# EAGLE design clock13 (EAGLE 7.7.0)
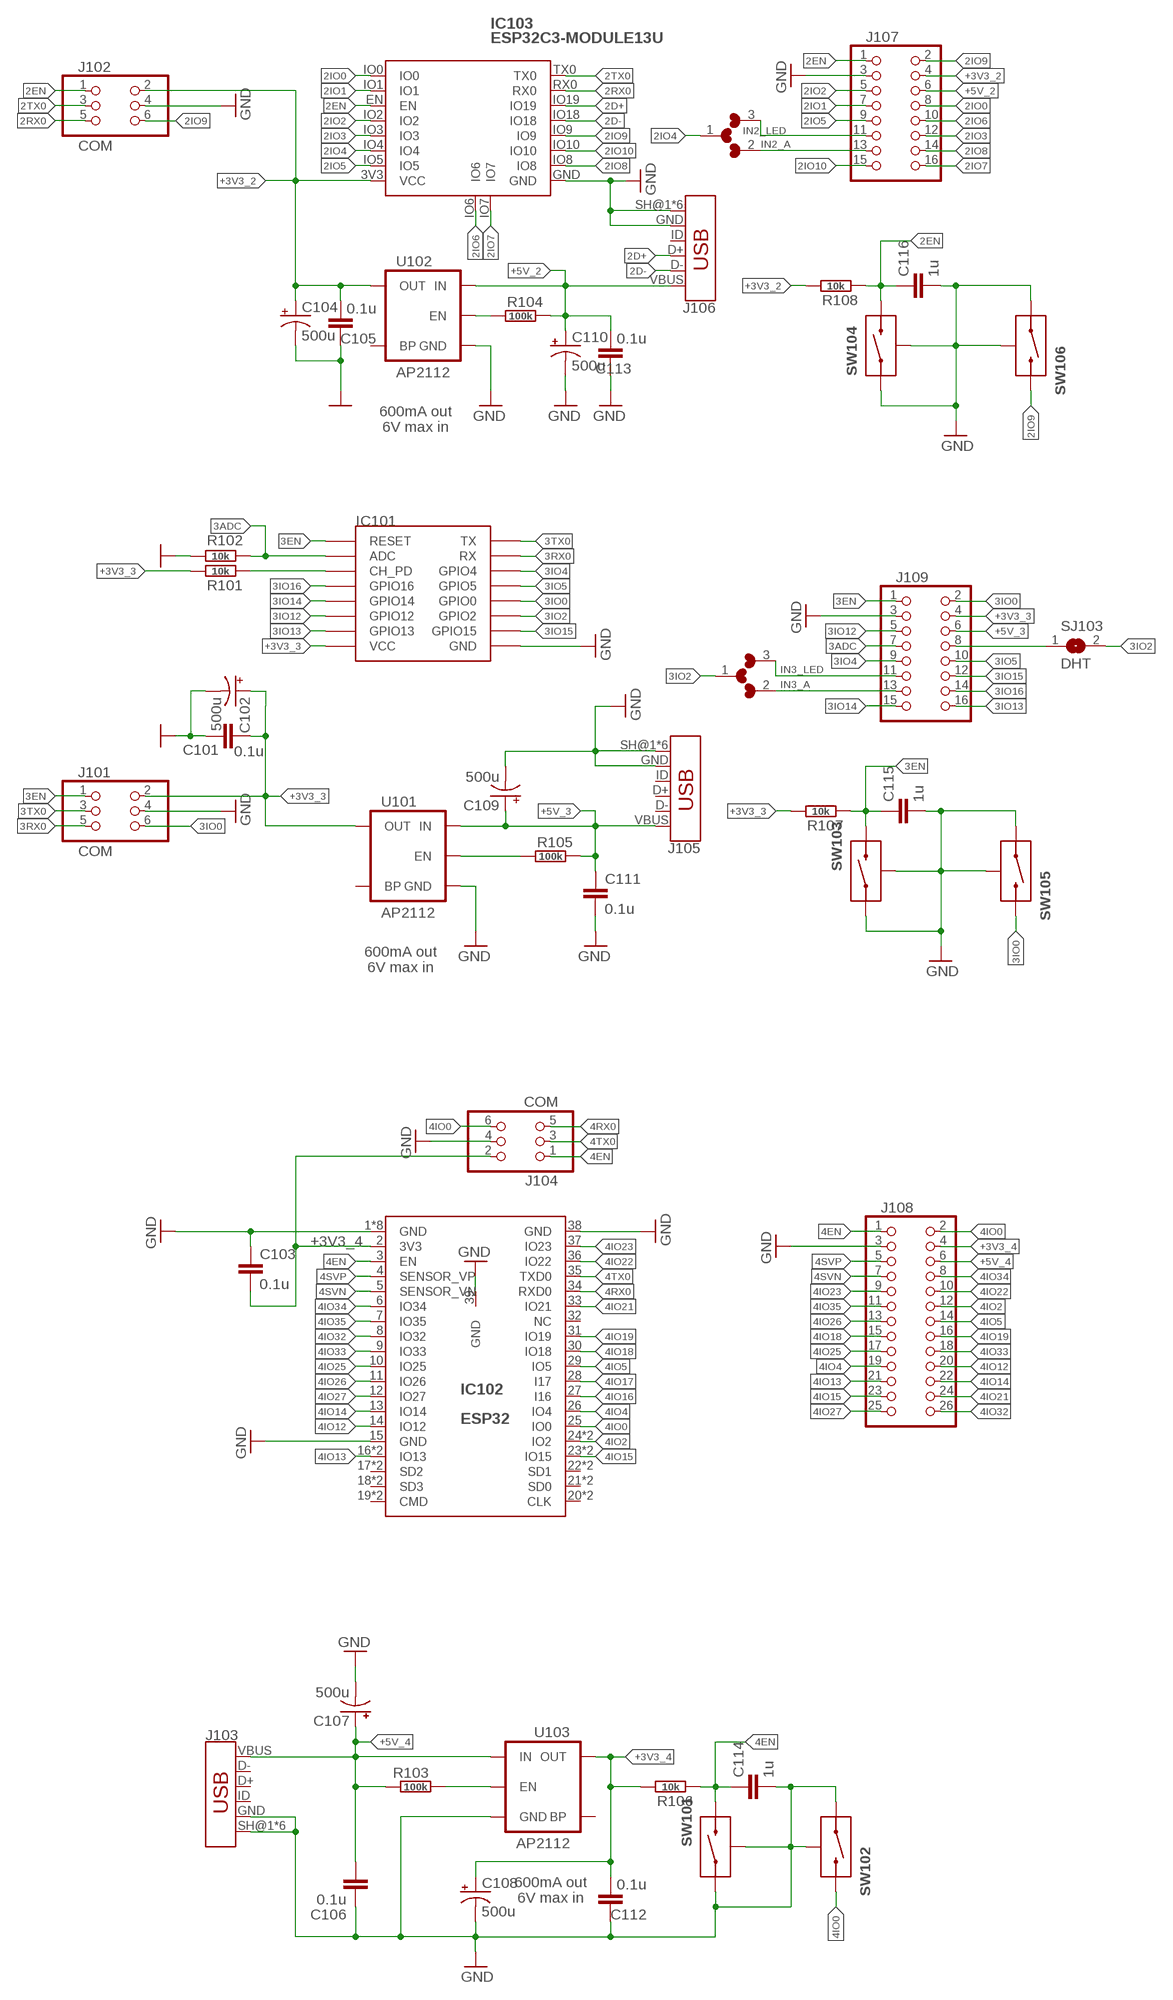
[diagram p0: schematic, sheet 1]

## Parts
C101  0.1u  CAP0603-CAP  [0603-CAP]
C102  500u  CAP_POLPTH1  [CPOL-RADIAL-100UF-25V]
C103  0.1u  CAP0603-CAP  [0603-CAP]
C104  500u  CAP_POLPTH1  [CPOL-RADIAL-100UF-25V]
C105  0.1u  CAP0603-CAP  [0603-CAP]
C106  0.1u  CAP0603-CAP  [0603-CAP]
C107  500u  CAP_POLPTH1  [CPOL-RADIAL-100UF-25V]
C108  500u  CAP_POLPTH1  [CPOL-RADIAL-100UF-25V]
C109  500u  CAP_POLPTH1  [CPOL-RADIAL-100UF-25V]
C110  500u  CAP_POLPTH1  [CPOL-RADIAL-100UF-25V]
C111  0.1u  CAP0603-CAP  [0603-CAP]
C112  0.1u  CAP0603-CAP  [0603-CAP]
C113  0.1u  CAP0603-CAP  [0603-CAP]
C114  1u  CAP0603-CAP  [0603-CAP]
C115  1u  CAP0603-CAP  [0603-CAP]
C116  1u  CAP0603-CAP  [0603-CAP]
IC101  ESP12SMD  [ESP12-SMD]
IC102  ESP32  ESP32-MODULEDUAL  [ESP32-WROOVER/WROOM]
IC103  ESP32C3-MODULE13U  [ESP32C3-13U]
J101  COM  HEADER-2X3SMT  [2X03_SMT]
J102  COM  HEADER-2X3SMT  [2X03_SMT]
J103  USB_MICRO-BFEMALE_SMT_  [USB-B-MICRO-SMD_MY]
J104  COM  HEADER-2X3SMT  [2X03_SMT]
J105  USB_MICRO-BFEMALE_SMT_  [USB-B-MICRO-SMD_MY]
J106  USB_MICRO-BFEMALE_SMT_  [USB-B-MICRO-SMD_MY]
J107  HEADER-2X8  [2X8]
J108  HEADER-2X13  [2X13]
J109  HEADER-2X8  [2X8]
R101  10k  R-EU_R0603  [R0603]
R102  10k  R-EU_R0603  [R0603]
R103  100k  R-EU_R0603  [R0603]
R104  100k  R-EU_R0603  [R0603]
R105  100k  R-EU_R0603  [R0603]
R106  10k  R-EU_R0603  [R0603]
R107  10k  R-EU_R0603  [R0603]
R108  10k  R-EU_R0603  [R0603]
SJ101  L/W  MICROBUILDER_SOLDERJUMPER3  [MICROBUILDER_SOLDERJUMPER_ARROW_NOPASTE_3]
SJ102  L/W  MICROBUILDER_SOLDERJUMPER3  [MICROBUILDER_SOLDERJUMPER_ARROW_NOPASTE_3]
SJ103  DHT  MICROBUILDER_SOLDERJUMPER  [MICROBUILDER_SOLDERJUMPER_ARROW_NOPASTE]
SW101  RST  MICROSWITCH-BUTTON  [MICROPUSH-BUT_TOP]
SW102  PRG  MICROSWITCH-BUTTON  [MICROPUSH-BUT_TOP]
SW103  RST  MICROSWITCH-BUTTON  [MICROPUSH-BUT_TOP]
SW104  RST  MICROSWITCH-BUTTON  [MICROPUSH-BUT_TOP]
SW105  PRG  MICROSWITCH-BUTTON  [MICROPUSH-BUT_TOP]
SW106  PRG  MICROSWITCH-BUTTON  [MICROPUSH-BUT_TOP]
U101  AP2112  V_REG_LDOSMD  [SOT23-5]
U102  AP2112  V_REG_LDOSMD  [SOT23-5]
U103  AP2112  V_REG_LDOSMD  [SOT23-5]

## Nets
1EN_P: R103.2 U103.3(EN)
2D+: IC103.IO19 J106.D+
2D-: IC103.IO18 J106.D-
2EN: C116.1 IC103.EN J102.1 J107.1 R108.1 SW104.B
2EN_P: R104.2 U102.3(EN)
2IO0: IC103.IO0 J107.8
2IO1: IC103.IO1 J107.7
2IO2: IC103.IO2 J107.5
2IO3: IC103.IO3 J107.12
2IO4: IC103.IO4 SJ101.1
2IO5: IC103.IO5 J107.9
2IO6: IC103.IO6 J107.10
2IO7: IC103.IO7 J107.16
2IO8: IC103.IO8 J107.14
2IO9: IC103.IO9 J102.6 J107.2 SW106.B
2IO10: IC103.IO10 J107.15
2RX0: IC103.RX0 J102.5
2TX0: IC103.TX0 J102.3
3ADC: IC101.ADC J109.7 R102.1
3EN: C115.1 IC101.RESET J101.1 J109.1 R107.1 SW103.B
3EN_P: R105.2 U101.3(EN)
3IO0: IC101.GPIO0 J101.6 J109.2 SW105.B
3IO2: IC101.GPIO2 SJ102.1 SJ103.2
3IO4: IC101.GPIO4 J109.9
3IO5: IC101.GPIO5 J109.10
3IO12: IC101.GPIO12 J109.5
3IO13: IC101.GPIO13 J109.16
3IO14: IC101.GPIO14 J109.15
3IO15: IC101.GPIO15 J109.12
3IO16: IC101.GPIO16 J109.14
3RX0: IC101.RXD0(RX) J101.5
3TX0: IC101.TXD0(TX) J101.3
4EN: C114.1 IC102.3(EN) J104.1 J108.1 R106.1 SW101.B
4IO0: IC102.25(IO0) J104.6 J108.2 SW102.B
4IO2: IC102.24(IO2) IC102.48(IO2) J108.12
4IO4: IC102.26(IO4) J108.19
4IO5: IC102.29(IO5) J108.14
4IO12: IC102.14(IO12) J108.20
4IO13: IC102.16(IO13) IC102.40(IO13) J108.21
4IO14: IC102.13(IO14) J108.22
4IO15: IC102.23(IO15) IC102.47(IO15) J108.23
4IO16: IC102.27(I16)
4IO17: IC102.28(I17)
4IO18: IC102.30(IO18) J108.15
4IO19: IC102.31(IO19) J108.16
4IO21: IC102.33(IO21) J108.24
4IO22: IC102.36(IO22) J108.10
4IO23: IC102.37(IO23) J108.9
4IO25: IC102.10(IO25) J108.17
4IO26: IC102.11(IO26) J108.13
4IO27: IC102.12(IO27) J108.25
4IO32: IC102.8(IO32) J108.26
4IO33: IC102.9(IO33) J108.18
4IO34: IC102.6(IO34) J108.8
4IO35: IC102.7(IO35) J108.11
4RX0: IC102.34(RXD0) J104.5
4SVN: IC102.5(SENSOR_VN) J108.7
4SVP: IC102.4(SENSOR_VP) J108.5
4TX0: IC102.35(TXD0) J104.3
+3V3_2: C104.1(+) C105.2 IC103.3V3(VCC) J102.2 J107.4 R108.2 U102.5(OUT)
+3V3_3 [power]: C101.2 C102.1(+) IC101.VCC J101.2 J109.4 R101.2 R107.2 U101.5(OUT)
+3V3_4: C103.2 C108.1(+) C112.2 IC102.2(3V3) J104.2 J108.4 R106.2 U103.5(OUT)
+5V_2: C110.1(+) C113.2 J106.VBUS J107.6 R104.1 U102.1(IN)
+5V_3 [power]: C109.1(+) C111.1 J105.VBUS J109.6 R105.1 U101.1(IN)
+5V_4: C106.1 C107.1(+) J103.VBUS J108.6 R103.1 U103.1(IN)
GND: C101.1 C102.2(-) C103.1 C104.2(-) C105.1 C106.2 C107.2(-) C108.2(-) C109.2(-) C110.2(-) C111.2 C112.1 C113.1 C114.2 C115.2 C116.2 IC101.GND IC102.1(GND) IC102.15(GND) IC102.38(GND) IC102.39(GND) IC102.GND IC102.PAD$1(GND) IC102.PAD$4(GND) IC102.PAD$5(GND) IC102.PAD$7(GND) IC102.PAD$8(GND) IC102.PAD$9(GND) IC103.GND J101.4 J102.4 J103.GND J103.SH@1(SHIELD) J103.SH@2(SHIELD) J103.SH@3(SHIELD) J103.SH@4(SHIELD) J103.SH@5(SHIELD) J103.SH@6(SHIELD) J104.4 J105.GND J105.SH@1(SHIELD) J105.SH@2(SHIELD) J105.SH@3(SHIELD) J105.SH@4(SHIELD) J105.SH@5(SHIELD) J105.SH@6(SHIELD) J106.GND J106.SH@1(SHIELD) J106.SH@2(SHIELD) J106.SH@3(SHIELD) J106.SH@4(SHIELD) J106.SH@5(SHIELD) J106.SH@6(SHIELD) J107.3 J108.3 J109.3 R102.2 SW101.A SW101.SH0(SH) SW102.A SW102.SH0(SH) SW103.A SW103.SH0(SH) SW104.A SW104.SH0(SH) SW105.A SW105.SH0(SH) SW106.A SW106.SH0(SH) U101.2(GND) U102.2(GND) U103.2(GND)
IN2_A: J107.13 SJ101.2
IN2_LED: J107.11 SJ101.3
IN3_A: J109.13 SJ102.2
IN3_DHT: J109.8 SJ103.1
IN3_LED: J109.11 SJ102.3
N$1: IC101.CH_PD R101.1
Unconnected: IC102.17(SD2) IC102.18(SD3) IC102.19(CMD) IC102.20(CLK) IC102.21(SD0) IC102.22(SD1) IC102.32(NC) IC102.41(SD2) IC102.42(SD3) IC102.43(CMD) IC102.44(CLK) IC102.45(SD0) IC102.46(SD1) J103.D+ J103.D- J103.ID J105.D+ J105.D- J105.ID J106.ID U101.4(BP) U102.4(BP) U103.4(BP)

## Notes on the sheet
- 600mA out
  6V max in
- 600mA out
  6V max in
- 600mA out
  6V max in

## Library data of the parts
C101 C103 C105 C106 C111-C116 = radiva5:CAP: Capacitor Standard 0603 ceramic capacitor, and 0.1" leaded capacitor.
C102 C104 C107-C110 = radiva5:CAP_POL: Capacitor Polarized These are standard SMD and PTH capacitors. Normally 10uF, 47uF, and 100uF in electrolytic and tantalum varieties. Always verify the external diameter of the through hole cap, it varies with capacity, voltage, and manufacturer. The EIA devices should be standard.
IC101 = clock02:ESP12: ESP8266 Wifi module 12
IC102 = radiva5:ESP32-MODULE
IC103 = radiva5:ESP32C3-MODULE
J101 J102 J104 = radiva5:HEADER-2X3: PIN HEADER
J103 J105 J106 = radiva5:USB_MICRO-B: USB Type Micro-B Connector Male/female and PTH/SMT variants SparkFun Products: SparkFun microB USB Breakout <?https://www.sparkfun.com/products/12035?> SparkFun USB microB Plug Breakout <?https://www.sparkfun.com/products/10031?> SparkFun ESP8266 Thing <?https://www.sparkfun.com/products/13231?>
J107 J109 = radiva5:HEADER-2X8: PIN HEADER
J108 = radiva5:HEADER-2X13: PIN HEADER
R101-R108 = radiva5:R-EU_: RESISTOR, European symbol
SJ101 SJ102 = radiva5:MICROBUILDER_SOLDERJUMPER3: SMD Solder JUMPER Solder the two pads together to create a connection, or remove the solder to break it. REFLOW - Use this footprint for solder paste and reflow ovens. WAVE - Use this footprint for hand-soldering (larger pads). CLOSED - Has a trace between the two pads to ensure it is closed by default. The trace needs to be cut to disable the jumper, and can be closed again by creating a solder bridge between the two pads.
SJ103 = radiva5:MICROBUILDER_SOLDERJUMPER: SMD Solder JUMPER Solder the two pads together to create a connection, or remove the solder to break it. REFLOW - Use this footprint for solder paste and reflow ovens. WAVE - Use this footprint for hand-soldering (larger pads). CLOSED - Has a trace between the two pads to ensure it is closed by default. The trace needs to be cut to disable the jumper, and can be closed again by creating a solder bridge between the two pads.; BOM: EXCLUDE
SW101-SW106 = radiva5:MICROSWITCH-BUTTON
U101-U103 = SparkFun-PowerIC:V_REG_LDO: Voltage Regulator LDO Standard 150mA LDO voltage regulator in SOT-23 layout. Micrel part MIC5205. BP (by-pass) pin is used to lower output noise with 470pF cap.; PROD_ID: VREG-12457

## Net classes
0 default: clearance 0.205 mm
1 power: width 0.406 mm

## Board
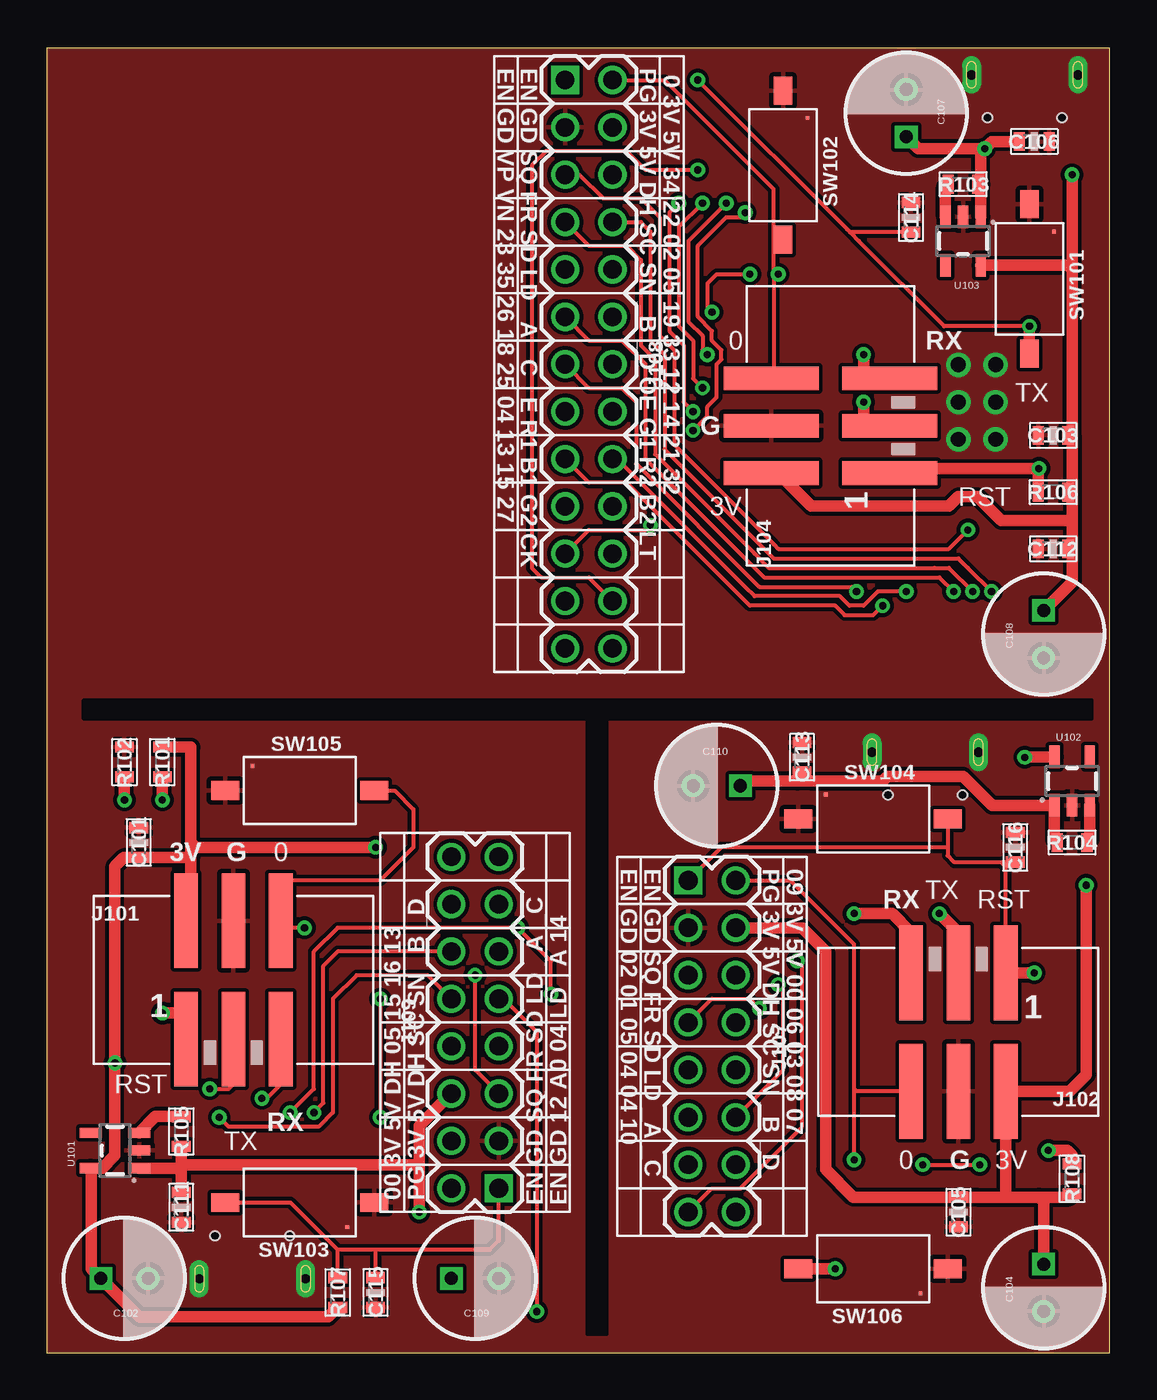
[diagram p1: board, top side]
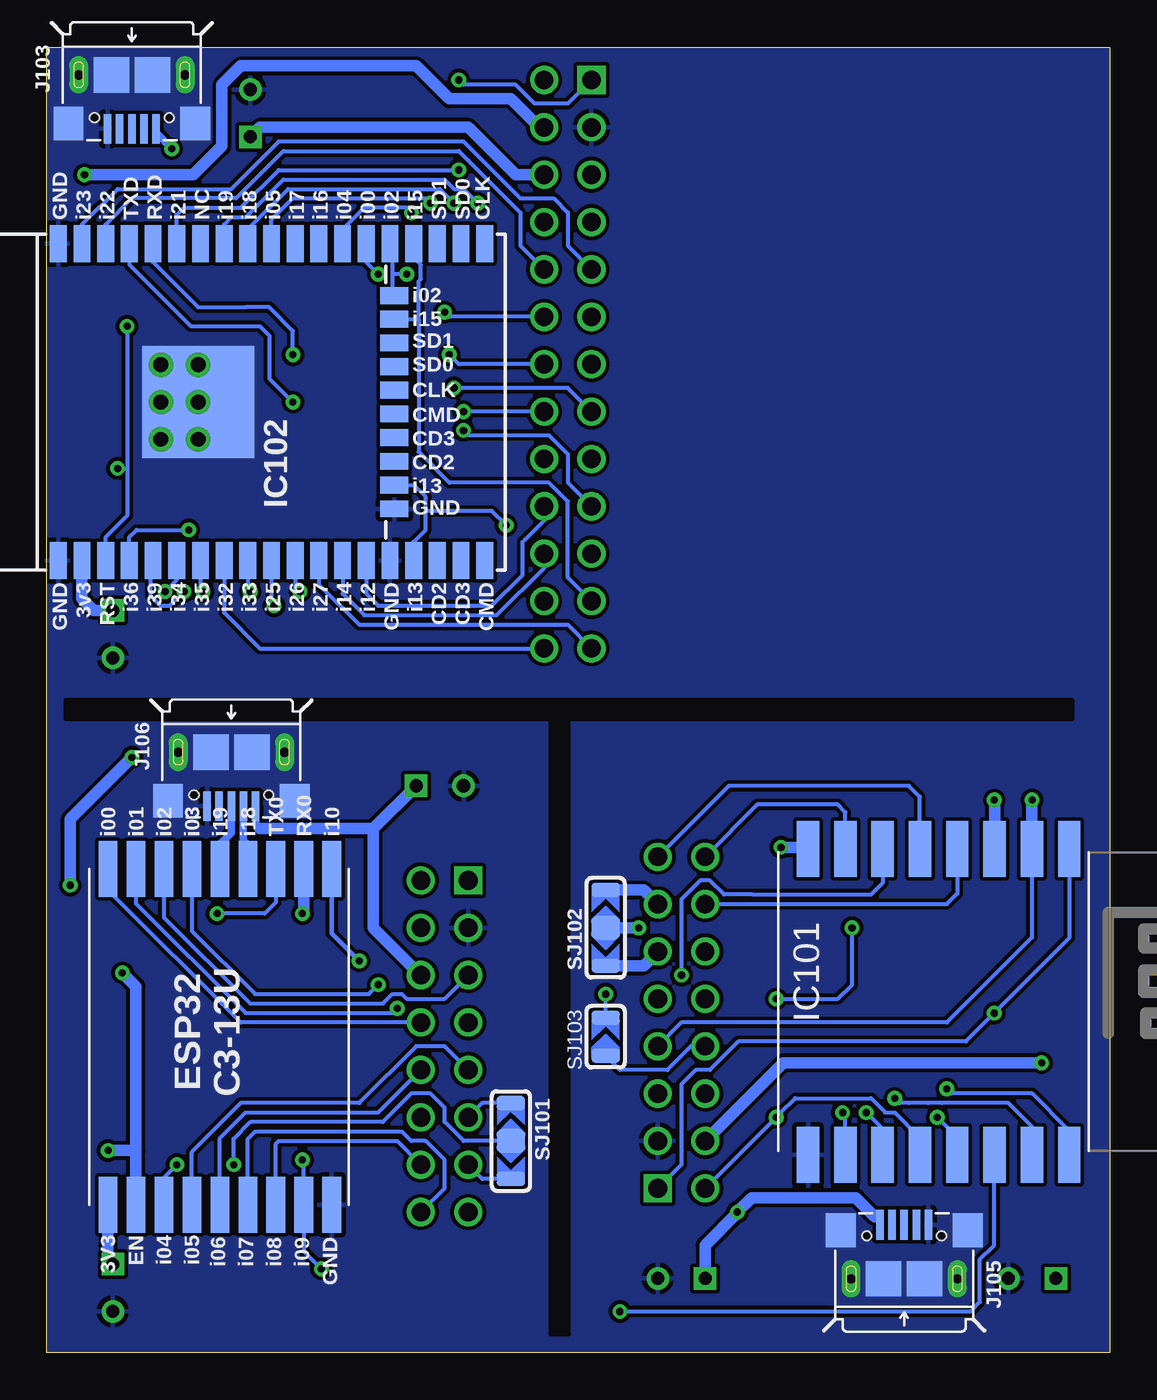
[diagram p2: board, bottom side, seen from below]

Size 57 x 70 mm. Coordinates in mm from the lower left corner, seen from the top.
Outline: 0,70 0,0 57,0 57,70 0,70
Copper layers (1*16): Top 0.035mm / dielectric 1.5mm / Bottom 0.035mm
Design rules "default *": minimum track width 8mil, minimum drill 15mil, track to track 8mil, track to pad 8mil, pad to pad 8mil, via to via 8mil, smd to smd 8mil, copper to edge 1mil, drill to drill 8mil, minimum pad ring 10mil, minimum via ring 8mil, stop-mask expansion 4mil, vias tented up to drill 20mil, thermal gap 10mil

### Footprints (pad centres in the part's own frame; a part is rotated, then mirrored left to right if it is on the bottom)
0603-CAP = smd 0.6 x 1: 1 -0.8,0; 2 0.8,0
CPOL-RADIAL-100UF-25V = drill 0.7 square: 1 1.27,0 | drill 0.7: 2 -1.27,0
ESP12-SMD = smd 3 x 1.2: ADC -8.3,3.8; CH_PD -8.3,1.8; GND 8.1,-8.2; GPIO0 8.1,-2.2; GPIO2 8.1,-4.2; GPIO4 8.1,1.8; GPIO5 8.1,-0.2; GPIO12 -8.3,-4.2; GPIO13 -8.3,-6.2; GPIO14 -8.3,-2.2; GPIO15 8.1,-6.2; GPIO16 -8.3,-0.2; RESET -8.3,5.8; RXD0 8.1,3.8; TXD0 8.1,5.8; VCC -8.3,-8.2
ESP32-WROOVER/WROOM = smd 2 x 0.9: 1 -8.5,7.5; 2 -8.5,6.23; 3 -8.5,4.96; 4 -8.5,3.69; 5 -8.5,2.42; 6 -8.5,1.15; 7 -8.5,-0.12; 8 -8.5,-1.39; 9 -8.5,-2.66; 10 -8.5,-3.93; 11 -8.5,-5.2; 12 -8.5,-6.47; 13 -8.5,-7.74; 14 -8.5,-9.01; 15 -8.5,-10.28; 16 -8.5,-11.55; 17 -8.5,-12.82; 18 -8.5,-14.09; 19 -8.5,-15.36; 20 8.5,-15.36; 21 8.5,-14.09; 22 8.5,-12.82; 23 8.5,-11.55; 24 8.5,-10.28; 25 8.5,-9.01; 26 8.5,-7.74; 27 8.5,-6.47; 28 8.5,-5.2; 29 8.5,-3.93; 30 8.5,-2.66; 31 8.5,-1.39; 32 8.5,-0.12; 33 8.5,1.15; 34 8.5,2.42; 35 8.5,3.69; 36 8.5,4.96; 37 8.5,6.23; 38 8.5,7.5 | smd 0.9 x 1.5: 39 -5.725,-10.5; 40 -4.445,-10.5; 41 -3.175,-10.5; 42 -1.905,-10.5; 43 -0.635,-10.5; 44 0.635,-10.5; 45 1.905,-10.5; 46 3.175,-10.5; 47 4.445,-10.5; 48 5.715,-10.5 | smd 6 x 6: GND 0,0 | drill 0.8: PAD$1 -2,2; PAD$4 0,2; PAD$5 2,2; PAD$7 -2,0; PAD$8 0,0; PAD$9 2,0
ESP32C3-13U = smd 3 x 1: 3V3 -9,5.6; EN -9,4.1; GND -9,-6.4; IO0 9,5.6; IO1 9,4.1; IO2 9,2.6; IO3 9,1.1; IO4 -9,2.6; IO5 -9,1.1; IO6 -9,-0.4; IO7 -9,-1.9; IO8 -9,-3.4; IO9 -9,-4.9; IO10 9,-6.4; IO18 9,-1.9; IO19 9,-0.4; RX0 9,-4.9; TX0 9,-3.4
2X03_SMT = smd 1.27 x 5.08: 1 -2.54,-3.175; 2 -2.54,3.175; 3 0,-3.175; 4 0,3.175; 5 2.54,-3.175; 6 2.54,3.175
USB-B-MICRO-SMD_MY = smd 1.6 x 0.4: D+ -4.4,0; D- -4.4,-0.65; GND -4.4,1.3; ID -4.4,0.65; VBUS -4.4,-1.3 | drill 0.5 long: SH@1 -1.5,-2.85; SH@2 -1.5,2.85 | smd 1.9 x 1.9: SH@3 -1.5,-1.1; SH@4 -1.5,1.1 | smd 1.8 x 1.6: SH@5 -4.1,-3.4; SH@6 -4.1,3.4 | hole 0.5: -3.8,-2; -3.8,2
2X8 = drill 1 square: 1 -8.89,-1.27 | drill 1: 2 -8.89,1.27; 3 -6.35,-1.27; 4 -6.35,1.27; 5 -3.81,-1.27; 6 -3.81,1.27; 7 -1.27,-1.27; 8 -1.27,1.27; 9 1.27,-1.27; 10 1.27,1.27; 11 3.81,-1.27; 12 3.81,1.27; 13 6.35,-1.27; 14 6.35,1.27; 15 8.89,-1.27; 16 8.89,1.27
2X13 = drill 1 square: 1 -15.24,-1.27 | drill 1: 2 -15.24,1.27; 3 -12.7,-1.27; 4 -12.7,1.27; 5 -10.16,-1.27; 6 -10.16,1.27; 7 -7.62,-1.27; 8 -7.62,1.27; 9 -5.08,-1.27; 10 -5.08,1.27; 11 -2.54,-1.27; 12 -2.54,1.27; 13 0,-1.27; 14 0,1.27; 15 2.54,-1.27; 16 2.54,1.27; 17 5.08,-1.27; 18 5.08,1.27; 19 7.62,-1.27; 20 7.62,1.27; 21 10.16,-1.27; 22 10.16,1.27; 23 12.7,-1.27; 24 12.7,1.27; 25 15.24,-1.27; 26 15.24,1.27
R0603 = smd 0.6 x 1: 1 -0.8,0; 2 0.8,0
MICROBUILDER_SOLDERJUMPER_ARROW_NOPASTE_3 = smd 1.27 x 1.524: 1 0,0 | smd 0.762 x 1.524: 2 2.032,0; 3 -2.032,0
MICROBUILDER_SOLDERJUMPER_ARROW_NOPASTE = smd 0.762 x 1.524: 1 -1.016,0; 2 1.016,0
MICROPUSH-BUT_TOP = smd 1.5 x 1: A -4,0; B 4,0 | smd 0.2 x 0.2: SH0 -2.54,1.31
SOT23-5 = smd 0.55 x 1.2: 1 -0.95,-1.3; 2 0,-1.3; 3 0.95,-1.3; 4 0.95,1.3; 5 -0.95,1.3

### Placement (x,y rotation side)
C101  4.93,27.37 270 top
C102  4.17,4 180 top
C103  53.96,49.21 0 top
C104  53.45,3.49 90 top
C105  48.88,7.55 90 top
C106  52.94,64.96 0 top
C107  46.08,66.48 270 top
C108  53.45,38.54 90 top
C109  22.97,4 180 top
C110  35.92,30.41 0 top
C111  7.22,7.81 270 top
C112  53.96,43.11 0 top
C113  40.49,31.94 270 top
C114  46.34,60.89 90 top
C115  17.63,3.24 270 top
C116  51.92,27.11 90 top
IC101  7.98,18.73 270 bottom
IC102  48.88,50.99 90 bottom
IC103  48.11,16.95 90 bottom
J101  10.01,20 0 top
J102  48.88,17.21 180 top
J103  52.43,70.04 90 bottom
J104  42.02,49.72 90 top
J105  11.03,2.47 270 bottom
J106  47.1,33.72 90 bottom
J107  35.67,16.44 270 top
J108  29.06,53.02 270 top
J109  22.97,17.71 90 top
R101  6.2,31.68 90 top
R102  4.17,31.68 90 top
R103  49.13,62.67 180 top
R104  54.97,27.37 0 top
R105  7.22,11.87 90 top
R106  53.96,46.16 0 top
R107  15.6,3.24 270 top
R108  54.97,9.33 270 top
SJ101  32.11,11.36 270 bottom
SJ102  27.03,22.79 90 bottom
SJ103  27.03,16.95 90 bottom
SW101  52.69,57.59 270 top
SW102  39.48,63.69 270 top
SW103  13.57,8.06 180 top
SW104  44.3,28.64 0 top
SW105  13.57,30.16 0 top
SW106  44.3,4.51 180 top
U101  3.66,10.86 90 top
U102  54.97,30.67 0 top
U103  49.13,59.62 180 top

### Tracks (layer width: path | path; a pad name or v marks a point on that pad's centre or on a via)
1EN_P
  Top 0.61: U103.3 48.18,62.52 R103.2
2D+
  Bottom 0.406: J106.D+ 47.1,27.87 47.71,27.26 IC103.IO19
2D-
  Bottom 0.406: J106.D- 46.45,27.48 46.21,27.24 IC103.IO18
2EN  (via drill 0.38)
  Top 0.203: SW104.B 48.3,27.11 | 48.3,27.11 48.3,26.67 48.66,26.31 51.16,26.31 | 48.3,27.11 36.18,27.11 J107.1 | C116.1 51.16,26.31 | J102.1 51.42,26.06 51.16,26.31
  Top 0.61: J102.1 v52.94,20.38 | R108.1 54.97,10.6 54.72,10.86 v53.7,10.86
  Bottom 0.61: IC103.EN 52.21,10.86 | 52.21,10.86 52.21,19.66 v52.94,20.38 | v53.7,10.86 52.21,10.86
2EN_P
  Top 0.61: U102.3 55.92,27.52 R104.2
2IO0
  Bottom 0.203: IC103.IO0 53.71,24.84 46.59,17.71 J107.8
2IO1  (via drill 0.38)
  Top 0.203: J107.7 35.67,18.98 37.7,18.98 v38.21,18.48
  Bottom 0.203: IC103.IO1 52.21,24.1 46.34,18.22 38.46,18.22 v38.21,18.48
2IO2
  Bottom 0.203: IC103.IO2 50.71,23.36 46.08,18.73 38.97,18.73 38.46,19.24 37.95,19.24 37.7,18.98 35.67,18.98 J107.5
2IO3  (via drill 0.38)
  Top 0.203: J107.12 39.48,15.17 39.48,19.49 v39.22,19.75
  Bottom 0.203: IC103.IO3 49.21,22.62 45.83,19.24 39.73,19.24 v39.22,19.75
2IO4  (via drill 0.38)
  Top 0.203: v46.97,10.09 v50.02,10.09
  Bottom 0.203: IC103.IO4 50.71,9.4 v50.02,10.09 | v46.97,10.09 46.97,11.49 46.08,12.38 38.97,12.38 37.45,13.9 36.43,13.9 35.67,13.14 35.67,12.38 34.65,11.36 SJ101.1
2IO5
  Bottom 0.203: J107.9 35.67,16.44 37.19,16.44 40.24,13.4 46.59,13.4 49.21,10.77 IC103.IO5
2IO6
  Bottom 0.203: J107.10 39.22,12.89 46.34,12.89 47.71,11.51 IC103.IO6
2IO7
  Bottom 0.203: IC103.IO7 46.21,11.49 45.83,11.87 37.95,11.87 37.45,11.36 36.68,11.36 35.67,10.35 35.67,8.82 J107.16
2IO8
  Bottom 0.203: IC103.IO8 44.71,11.21 44.56,11.36 38.21,11.36 J107.14
2IO9  (via drill 0.38)
  Top 0.203: v43.29,10.35 43.29,14.16 | 43.29,14.16 43.29,21.91 39.86,25.33 J107.2 | J102.6 43.41,14.03 43.29,14.16
  Top 0.61: SW106.B v42.27,4.51
  Bottom 0.203: v43.29,10.35 43.21,10.27 IC103.IO9 43.21,5.45 v42.27,4.51
2IO10  (via drill 0.38)
  Top 0.203: J107.15 35.67,8.82 37.19,8.82 40.49,12.13 40.49,20.76 v40.24,21.02
  Bottom 0.254: IC103.IO10 41.71,22.49 v40.24,21.02
2RX0  (via drill 0.38)
  Top 0.61: v43.29,23.56 45.32,23.56 46.34,22.54 J102.5
  Bottom 0.203: 43.21,23.63 v43.29,23.56
  Bottom 0.61: IC103.RX0 43.21,23.63
2TX0  (via drill 0.38)
  Top 0.61: J102.3 48.88,22.54 v47.86,23.56
  Bottom 0.203: IC103.TX0 44.71,24.16 45.32,23.56 v47.86,23.56
3ADC  (via drill 0.38)
  Top 0.61: v4.17,29.65 R102.1
  Bottom 0.203: IC101.ADC 4.18,22.28 8.74,17.71 22.97,17.71 J109.7
  Bottom 0.61: IC101.ADC 4.18,29.64 v4.17,29.65
3EN  (via drill 0.38)
  Top 0.203: J109.1 24.24,6.03 23.73,5.52 17.63,5.52 | 17.63,5.52 15.6,5.52 | C115.1 17.63,5.52 | R107.1 15.6,5.52 | SW103.B 13.06,8.06 15.6,5.52
  Top 0.61: v6.2,18.22 7.47,18.22 J101.1
  Bottom 0.203: IC101.RESET 2.18,22.24 v6.2,18.22 7.73,16.7 19.92,16.7 21.44,15.17 22.21,15.17 22.97,14.41 22.97,10.09 J109.1
3EN_P
  Top 0.61: R105.2 5.83,12.67 U101.3
3IO0  (via drill 0.38)
  Top 0.203: J101.6 12.55,23.56 J101.6 | v17.89,18.98 v17.89,12.63 | v13.82,22.79 12.94,22.79 J101.6 | SW105.B 18.65,30.16 19.67,29.14 19.67,27.11 17.89,25.33 12.81,25.33 12.55,25.08 J101.6
  Bottom 0.203: J109.2 v17.89,12.63 17.63,12.89 16.87,13.65 12.81,13.65 12.05,12.89 11.54,12.89 10.18,11.53 IC101.GPIO0 | v17.89,18.98 14.59,18.98 13.82,19.75 v13.82,22.79
3IO2  (via drill 0.38)
  Top 0.203: v27.03,19.24 27.03,21.02 v25.25,22.79 15.6,22.79 14.33,21.52 14.33,14.16 v13.06,12.89
  Bottom 0.203: SJ103.2 v27.03,19.24 | IC101.GPIO2 12.18,12.01 v13.06,12.89
  Bottom 0.61: SJ102.1 v25.25,22.79
3IO4  (via drill 0.38)
  Top 0.203: J109.9 24.49,18.98 26.27,17.21 v26.27,2.22
  Bottom 0.203: v26.27,2.22 7.47,2.22 6.97,2.73 6.97,5.01 6.2,5.78 6.2,10.61 IC101.GPIO4
3IO5  (via drill 0.38)
  Top 0.203: v9.25,12.63 9.76,12.13 14.59,12.13 15.35,12.89 15.35,18.98 16.62,20.25 20.43,20.25 J109.10
  Bottom 0.203: IC101.GPIO5 8.18,11.56 v9.25,12.63
3IO12  (via drill 0.38)
  Top 0.203: J109.5 22.97,15.17 v22.97,20.25
  Bottom 0.203: IC101.GPIO12 12.18,25.2 12.3,25.08 12.81,24.57 19.16,24.57 20.68,24.57 21.44,25.33 21.95,25.33 22.97,24.32 v22.97,20.25
3IO13
  Bottom 0.203: IC101.GPIO13 14.18,28.99 14.59,29.4 18.9,29.4 J109.16
3IO14
  Bottom 0.203: IC101.GPIO14 10.18,29.82 10.78,30.41 20.43,30.41 J109.15
3IO15  (via drill 0.38)
  Top 0.203: v14.33,12.89 14.84,13.4 14.84,20.76 15.6,21.52 J109.12
  Bottom 0.203: IC101.GPIO15 14.18,12.74 v14.33,12.89
3IO16
  Bottom 0.203: J109.14 8.74,24.06 8.24,24.57 8.18,24.63 IC101.GPIO16
3RX0  (via drill 0.38)
  Top 0.203: J101.5 12.55,14.41 11.79,13.65 v11.54,13.65
  Bottom 0.203: v11.54,13.65 11.28,13.4 10.78,13.4 9.76,13.4 9,13.4 5.44,13.4 4.18,12.14 IC101.RXD0
3TX0  (via drill 0.38)
  Top 0.203: J101.3 10.01,14.92 10.01,14.41 9.76,14.16 v8.74,14.16
  Bottom 0.203: IC101.TXD0 2.18,11.91 4.17,13.9 8.49,13.9 v8.74,14.16
4EN  (via drill 0.38)
  Top 0.203: 43.07,60.09 42.91,60.26 | 42.91,60.26 v34.91,68.26 | 43.07,60.09 43.54,59.62 48.11,55.05 v52.69,55.05 | C114.1 43.07,60.09 | 43.07,60.09 42.91,60.26
  Top 0.61: R106.1 53.16,47.39 v53.19,47.43 46.08,47.43 45.83,47.18 J104.1 | SW101.B v52.69,55.05
  Bottom 0.203: IC102.3 53.84,43.74 52.69,44.89 52.69,47.43 | v52.69,55.05 52.69,47.43 | J108.1 29.06,66.99 30.84,66.99 31.86,68.01 34.65,68.01 v34.91,68.26 | v53.19,47.43 52.69,47.43
4IO0  (via drill 0.38)
  Top 0.203: v39.22,57.85 38.97,57.85 | 38.97,57.85 38.97,59.62 | 38.97,59.62 38.97,59.75 38.97,62.42 33.13,68.26 J108.2 | 38.97,57.85 38.97,52.38 J104.6 | SW102.B 39.03,59.69 38.97,59.62
  Bottom 0.203: IC102.25 39.87,58.49 v39.22,57.85
4IO2  (via drill 0.38)
  Top 0.203: v37.7,57.85 35.92,57.85 35.41,57.34 35.41,56.07 v35.67,55.81
  Bottom 0.203: IC102.24 38.58,59.49 38.46,59.37 38.46,57.85 | 38.46,57.85 38.46,56.79 IC102.48 | v37.7,57.85 38.46,57.85 | J108.12 35.41,55.56 v35.67,55.81
4IO4  (via drill 0.38)
  Top 0.203: v34.65,49.46 35.41,50.23 35.41,50.73 35.92,51.24 35.92,53.02 36.18,53.27 36.18,53.78 35.67,54.29 35.67,54.8 34.91,55.56 34.91,59.37 36.43,60.89 37.19,60.89 v37.45,61.15
  Bottom 0.203: v34.65,49.46 34.4,49.21 30.08,49.21 29.06,48.19 29.06,46.67 J108.19 | v37.45,61.15 37.7,61.4 39.99,61.4 41,60.39 41.14,60.25 IC102.26
4IO5  (via drill 0.38)
  Top 0.203: v36.43,61.66 34.4,59.62 34.4,55.31 35.16,54.54 35.16,53.78 v35.41,53.53
  Bottom 0.203: IC102.29 44.95,60.76 43.8,61.91 36.68,61.91 v36.43,61.66 | J108.14 34.91,53.02 v35.41,53.53
4IO12
  Bottom 0.203: IC102.14 39.87,40.71 39.22,40.07 33.13,40.07 31.48,41.72 31.48,43.5 31.35,43.62 30.33,44.64 J108.20
4IO13  (via drill 0.38)
  Top 0.203: J108.21 29.06,44.13 32.11,44.13 v32.37,44.38
  Bottom 0.203: IC102.16 37.33,43.49 36.68,44.13 36.68,45.15 | 36.68,45.15 36.68,45.91 37.32,46.54 IC102.40 | v32.37,44.38 33.13,45.15 36.68,45.15
4IO14
  Bottom 0.203: IC102.13 41.14,40.71 39.99,39.56 32.87,39.56 30.33,42.1 J108.22
4IO15
  Bottom 0.203: J108.23 29.06,41.59 29.06,45.65 30.08,46.67 35.41,46.67 37.06,48.32 37.06,55.43 | 37.19,59.37 37.33,59.5 IC102.23 37.33,58.74 36.94,58.35 36.94,57.59 37.06,57.47 37.06,55.43 | IC102.47 37.06,55.43
4IO18  (via drill 0.38)
  Top 0.203: v35.16,61.66 33.89,60.39 33.89,55.05 34.65,54.29 34.65,52.26 v35.16,51.75
  Bottom 0.203: IC102.30 46.22,60.25 44.05,62.42 35.92,62.42 v35.16,61.66 | J108.15 29.06,51.75 34.4,51.75 v35.16,51.75
4IO19  (via drill 0.38)
  Top 0.203: v33.89,61.66 33.38,61.15 33.38,54.8 34.14,54.04 34.14,50.99 v34.65,50.48
  Bottom 0.203: J108.16 v34.65,50.48 | IC102.31 47.49,60.51 47.1,60.89 46.34,60.89 44.3,62.93 35.67,62.93 35.16,62.42 34.65,62.42 v33.89,61.66
4IO21  (via drill 0.38)
  Top 0.203: v34.91,63.43 32.11,63.43 31.1,64.45 26.78,64.45 26.02,63.69 26.02,42.1 26.52,41.59 29.06,41.59 J108.24
  Bottom 0.203: IC102.33 50.03,61.01 49.64,61.4 46.59,61.4 44.56,63.43 v34.91,63.43
4IO22
  Bottom 0.203: J108.10 31.35,59.12 31.6,59.37 31.6,61.15 34.4,63.94 34.91,64.45 44.3,64.45 44.81,63.94 46.84,61.91 52.43,61.91 53.84,60.51 IC102.36
4IO23
  Bottom 0.203: J108.9 29.06,59.37 29.06,61.15 29.83,61.91 31.6,61.91 34.65,64.96 44.56,64.96 47.1,62.42 53.19,62.42 55.11,60.51 IC102.37
4IO25  (via drill 0.38)
  Top 0.203: J108.17 29.06,46.67 31.1,46.67 37.19,40.57 37.7,40.07 42.27,40.07 42.78,39.56 44.3,39.56 v44.81,40.07
  Bottom 0.203: IC102.10 44.95,40.2 v44.81,40.07
4IO26  (via drill 0.38)
  Top 0.203: J108.13 29.06,51.75 30.84,51.75 31.6,50.99 31.6,47.69 38.21,41.08 43.16,41.08 v43.41,40.83
  Bottom 0.203: IC102.11 43.68,41.09 v43.41,40.83
4IO27
  Bottom 0.203: IC102.12 42.41,41.22 40.24,39.05 29.06,39.05 J108.25
4IO32
  Bottom 0.203: IC102.8 47.49,39.69 45.57,37.78 J108.26
4IO33  (via drill 0.38)
  Top 0.203: J108.18 30.59,47.94 37.45,41.08 37.95,40.57 42.53,40.57 43.03,40.07 43.8,40.07 44.56,40.83 v46.08,40.83
  Bottom 0.203: IC102.9 46.22,40.96 v46.08,40.83
4IO34  (via drill 0.38)
  Top 0.203: J108.8 31.86,60.64 32.37,60.13 32.37,54.29 33.13,53.53 33.13,48.45 37.95,43.62 38.97,42.61 48.88,42.61 49.38,42.1 v50.65,40.83
  Bottom 0.203: IC102.6 50.03,41.46 v50.65,40.83
4IO35  (via drill 0.38)
  Top 0.203: v48.62,40.83 47.86,41.59 38.46,41.59 32.11,47.94 32.11,53.02 30.84,54.29 29.06,54.29 J108.11
  Bottom 0.203: IC102.7 48.76,40.96 v48.62,40.83
4RX0  (via drill 0.38)
  Top 0.61: J104.5 43.8,52.26 v43.8,53.53
  Bottom 0.203: IC102.34 51.3,58.49 48.88,56.07 46.34,56.07 45.07,56.07 43.8,54.8 v43.8,53.53
4SVN  (via drill 0.38)
  Top 0.203: J108.7 29.06,59.37 31.1,59.37 31.86,58.61 31.86,54.04 32.62,53.27 32.62,48.19 37.95,42.86 38.72,42.1 47.61,42.1 48.37,42.1 v49.64,40.83
  Bottom 0.203: IC102.5 51.42,42.37 51.42,40.57 50.91,40.07 50.4,40.07 v49.64,40.83
4SVP  (via drill 0.38)
  Top 0.203: J108.5 28.56,63.18 29.83,61.91 31.86,61.91 32.87,60.89 32.87,54.54 33.64,53.78 33.64,48.7 38.97,43.37 39.22,43.11 48.37,43.11 v49.38,44.13
  Bottom 0.203: IC102.4 52.57,43.74 52.18,44.13 v49.38,44.13
4TX0  (via drill 0.38)
  Top 0.61: J104.3 44.05,49.72 43.8,49.97 v43.8,50.99
  Bottom 0.203: IC102.35 52.57,58.35 49.26,55.05 48.88,55.05 45.57,55.05 45.07,54.54 45.07,52.26 v43.8,50.99
+3V3_2  (via drill 0.38)
  Top 0.61: J107.4 40.49,22.79 41.76,21.52 41.76,9.84 43.25,8.35 C105.2 49.85,8.35 51.42,8.35 | 51.42,8.35 53.19,8.35 | C104.1 53.45,8.1 53.19,8.35 | 53.19,8.35 54.79,8.35 R108.2 | v55.73,25.08 55.73,14.92 54.84,14.03 J102.2 51.42,8.35 | U102.5 52.46,31.97 v52.43,31.94
  Bottom 0.61: IC103.3V3 53.71,5.03 C104.1 | v55.73,25.08 55.73,28.64 v52.43,31.94
+3V3_3  (via drill 0.38)
  Top 0.61: R107.2 15.09,1.93 4.97,1.93 C102.1 2.39,4.51 2.39,9.88 U101.5 2.97,9.91 3.66,10.6 v3.66,15.55 3.66,26.1 4.13,26.57 C101.2 7.69,26.57 7.73,26.6 | R101.2 7.73,32.48 7.73,27.37 | J101.2 7.6,23.18 7.73,23.3 7.73,26.6 | 7.73,26.6 7.73,27.37 | v17.63,27.11 7.98,27.11 7.73,27.37
  Bottom 0.61: v17.63,27.11 16.26,27.11 IC101.VCC | v3.66,15.55 17.51,15.55 J109.4
+3V3_4  (via drill 0.38)
  Top 0.61: C103.2 54.97,49.21 | 54.97,49.21 54.97,58.1 | 54.97,58.1 v54.97,63.18 | U103.5 54.75,58.32 54.97,58.1 | J104.2 39.22,47.18 41,45.4 48.37,45.4 48.88,45.91 49.89,45.91 50.4,45.4 51.16,44.64 54.97,44.64 | 54.97,49.21 54.97,46.16 | 54.97,46.16 54.97,44.64 | 54.97,44.64 54.97,43.11 | 54.97,43.11 54.97,41.34 C108.1 | C112.2 54.97,43.11 | R106.2 54.97,46.16
  Bottom 0.61: J108.4 30.59,65.72 32.11,67.24 35.41,67.24 37.19,69.02 46.59,69.02 47.61,68.01 47.61,64.7 49.13,63.18 v54.97,63.18 | C108.1 54.46,39.81 55.11,40.45 IC102.2
+5V_2
  Top 0.61: R104.1 54.02,27.52 U102.1 51.92,29.37 50.68,29.37 50.18,29.87 49.13,30.92 45.07,30.92 44.81,30.67 42.53,30.67 42.27,30.67 41,30.67 40.24,30.67 | C113.2 40.53,31.14 40.53,30.96 40.24,30.67 | 40.24,30.67 37.45,30.67 C110.1
  Bottom 0.406: 45.57,28.13 45.8,28.35 J106.VBUS
  Bottom 0.61: J107.6 39.48,22.79 39.48,28.13 | 39.48,28.13 C110.1 | 45.57,28.13 39.48,28.13
+5V_3  (via drill 0.38)
  Top 0.61: R105.1 7.22,10.09 | 7.22,10.09 7.22,9.84 | 7.22,9.84 C111.1 | U101.1 7.15,9.91 7.22,9.84 | v19.97,7.55 19.97,10.09 | 19.97,10.09 19.97,12.18 J109.6 | 7.22,10.09 19.97,10.09
  Bottom 0.406: J105.VBUS 12.33,7.08 12.55,7.3
  Bottom 0.61: 12.55,7.3 12.61,7.3 13.62,8.32 19.21,8.32 v19.97,7.55 19.97,7.5 21.7,5.78 C109.1
+5V_4  (via drill 0.38)
  Top 0.61: U103.1 50.08,62.67 | R103.1 50.08,62.67 | v50.29,64.58 46.72,64.58 C107.1 | C106.1 50.67,64.96 v50.29,64.58 | 50.08,62.67 50.08,64.37 v50.29,64.58
  Bottom 0.406: J103.VBUS 51.13,65.42 v50.29,64.58
  Bottom 0.61: J108.6 31.86,63.18 34.4,65.72 45.57,65.72 C107.1
GND
  pour Top: 57,0 57,70 0,70 0,0
  pour Bottom: 57,0 57,70 0,70 0,0
IN2_A
  Bottom 0.203: SJ101.2 33.64,9.33 J107.13
IN2_LED
  Bottom 0.203: SJ101.3 33.64,13.4 J107.11
IN3_A
  Bottom 0.61: SJ102.2 25,24.83 J109.13
IN3_DHT
  Bottom 0.203: J109.8 22.46,16.44 23.73,15.17 26.27,15.17 SJ103.1
IN3_LED
  Bottom 0.61: SJ102.3 25,20.76 J109.11
N$1  (via drill 0.38)
  Top 0.61: v6.2,29.65 R101.1
  Bottom 0.61: IC101.CH_PD 6.18,29.63 v6.2,29.65
RET
  cutout Bottom: 56,34 30,34 30,1 29,1 29,34 2,34 2,35 56,35
  cutout Top: 2,35 56,35 56,34 30,34 30,1 29,1 29,34 2,34

### Text on the board
tPlace: EN GD VP VN 23 35 26 18 25 04 13 15 27 | EN GD SQ FR SD LD _A _C _E R1 B1 G2 CK | PG 3V 5V DH SC SN _B _D OE G1 R2 B2 LT | 0 3V 5V 34 22 02 05 19 33 12 14 21 32 | 0 | RX | TX | G | 3V | RST | 3V | G | 0 | EN GD 02 01 05 04 04 10 | EN GD SQ FR SD LD _A _C | PG 3V 5V DH SC SN _B _D | 09 3V 5V 00 06 03 08 07 | RX | TX | RST | RST | RX | TX | 0 | G | 3V | 00 3V 5V DH 05 15 16 13 | PG 3V 5V DH SC SN _B _D | EN GD SQ FR SD LD _A _C | EN GD 12 A0 04 LD _A 14